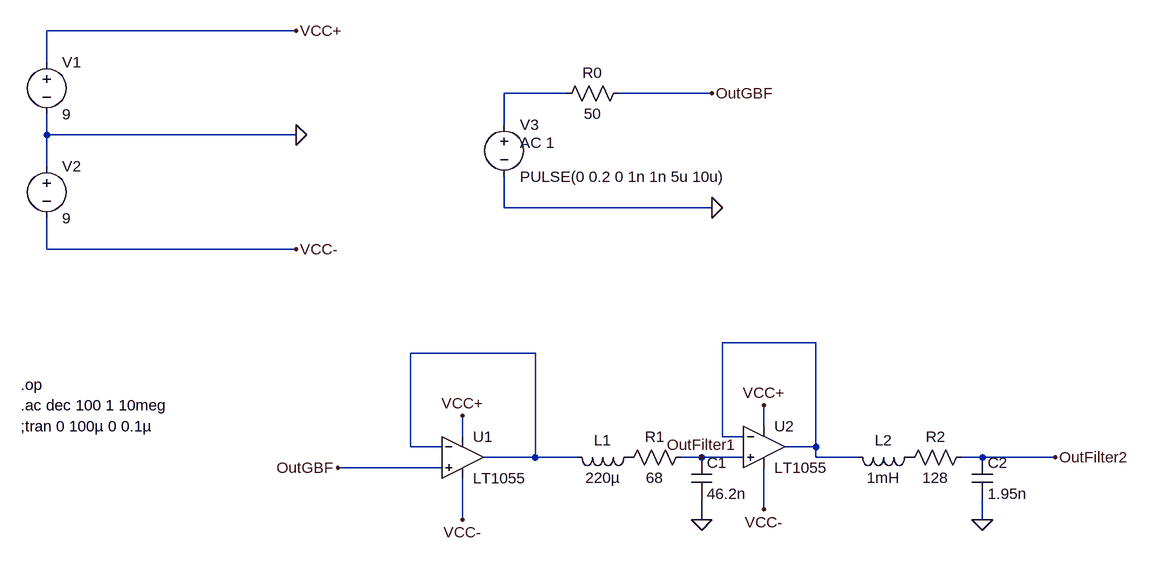
[diagram p0: schematic Draft1.asc]
Draft1.asc, the LTspice schematic file:
Version 4
SHEET 1 1160 680
WIRE -192 -496 -576 -496
WIRE -576 -448 -576 -496
WIRE 224 -400 128 -400
WIRE 448 -400 304 -400
WIRE 128 -352 128 -400
WIRE -576 -336 -576 -368
WIRE -192 -336 -576 -336
WIRE -576 -288 -576 -336
WIRE 128 -224 128 -272
WIRE 448 -224 128 -224
WIRE -576 -160 -576 -208
WIRE -192 -160 -576 -160
WIRE 608 -16 464 -16
WIRE 176 0 -16 0
WIRE 528 112 528 80
WIRE 64 128 64 96
WIRE 464 128 464 -16
WIRE 496 128 464 128
WIRE -16 144 -16 0
WIRE 32 144 -16 144
WIRE 608 144 608 -16
WIRE 608 144 560 144
WIRE 176 160 176 0
WIRE 176 160 96 160
WIRE 240 160 176 160
WIRE 432 160 400 160
WIRE 496 160 432 160
WIRE 608 160 608 144
WIRE 672 160 608 160
WIRE 864 160 832 160
WIRE 976 160 864 160
WIRE 32 176 -128 176
WIRE 528 240 528 176
WIRE 64 256 64 192
WIRE 432 256 432 224
WIRE 864 256 864 224
FLAG 64 96 VCC+
FLAG 64 256 VCC-
FLAG 528 80 VCC+
FLAG 528 240 VCC-
FLAG 432 256 0
FLAG 864 256 0
FLAG -128 176 OutGBF
FLAG 432 160 OutFilter1
FLAG 976 160 OutFilter2
FLAG -192 -336 0
FLAG 448 -224 0
FLAG -192 -496 VCC+
FLAG -192 -160 VCC-
FLAG 448 -400 OutGBF
SYMBOL OpAmps\\LT1055 64 96 R0
SYMATTR InstName U1
SYMBOL ind 336 144 R90
WINDOW 0 5 56 VBottom 2
WINDOW 3 32 56 VTop 2
SYMATTR InstName L1
SYMATTR Value 220µ
SYMBOL ind 768 144 R90
WINDOW 0 5 56 VBottom 2
WINDOW 3 32 56 VTop 2
SYMATTR InstName L2
SYMATTR Value 1mH
SYMBOL res 416 144 R90
WINDOW 0 0 56 VBottom 2
WINDOW 3 32 56 VTop 2
SYMATTR InstName R1
SYMATTR Value 68
SYMBOL res 848 144 R90
WINDOW 0 0 56 VBottom 2
WINDOW 3 32 56 VTop 2
SYMATTR InstName R2
SYMATTR Value 128
SYMBOL cap 416 160 R0
SYMATTR InstName C1
SYMATTR Value 46.2n
SYMBOL cap 848 160 R0
SYMATTR InstName C2
SYMATTR Value 1.95n
SYMBOL OpAmps\\LT1055 528 80 R0
SYMATTR InstName U2
SYMBOL voltage -576 -464 R0
WINDOW 123 0 0 Left 0
WINDOW 39 0 0 Left 0
SYMATTR InstName V1
SYMATTR Value 9
SYMBOL voltage -576 -304 R0
WINDOW 123 0 0 Left 0
WINDOW 39 0 0 Left 0
SYMATTR InstName V2
SYMATTR Value 9
SYMBOL voltage 128 -368 R0
WINDOW 123 24 44 Left 2
WINDOW 39 0 0 Left 0
SYMATTR Value2 AC 1
SYMATTR InstName V3
SYMATTR Value PULSE(0 0.2 0 1n 1n 5u 10u)
SYMBOL res 320 -416 R90
WINDOW 0 0 56 VBottom 2
WINDOW 3 32 56 VTop 2
SYMATTR InstName R0
SYMATTR Value 50
TEXT -616 48 Left 2 !.op
TEXT -616 80 Left 2 !.ac dec 100 1 10meg
TEXT -616 112 Left 2 !;tran 0 100µ 0 0.1µ

The netlist it stands for:
* Draft1.asc
XU1 OutGBF N003 VCC+ VCC- N003 LT1055  ; pins In+ In- V+ V- OUT
L1 P001 N003 220µ
L2 P002 N002 1mH
R1 OutFilter1 P001 68
R2 OutFilter2 P002 128
C1 OutFilter1 0 46.2n
C2 OutFilter2 0 1.95n
XU2 OutFilter1 N002 VCC+ VCC- N002 LT1055  ; pins In+ In- V+ V- OUT
V1 VCC+ 0 9
V2 0 VCC- 9
V3 N001 0 PULSE(0 0.2 0 1n 1n 5u 10u) AC 1
R0 OutGBF N001 50
.op
.ac dec 100 1 10meg
;tran 0 100µ 0 0.1µ
.backanno
.end

* Results of the author's LTspice run, read from the files saved beside the schematic
* Operating Point, zero values left out:
*   V(vcc+) = 9 V
*   V(vcc-) = -9 V
*   I(V2) = -5.6 mA
*   I(V1) = -5.6 mA
*   Ix(u1:3) = 2.8 mA
*   Ix(u1:4) = -2.8 mA
*   Ix(u2:3) = 2.8 mA
*   Ix(u2:4) = -2.8 mA
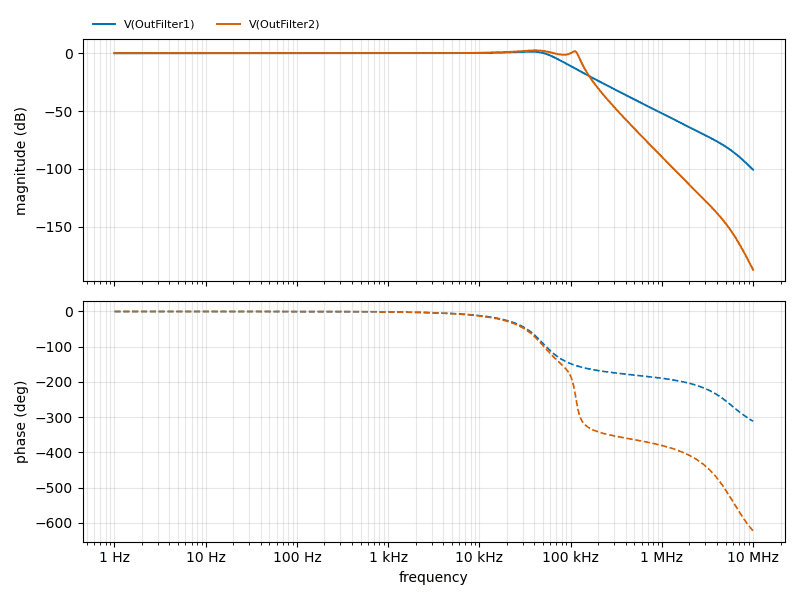
[diagram p1: AC Analysis of Draft1.asc, plotted from the saved traces]
* AC Analysis, 1 run:
*   V(OutFilter1): -0.00 dB at 1 Hz, -100.75 dB at 10 MHz, peak 1.35 dB at 35.48 kHz, 3 dB below the peak at 58.36 kHz
*   V(OutFilter2): -0.00 dB at 1 Hz, -187.15 dB at 10 MHz, peak 2.38 dB at 40.74 kHz, 3 dB below the peak at 70.53 kHz
* From the log:
*   Semiconductor Device Operating Points:
*                           --- Diodes ---
*   Name:    d:u2:3      d:u2:6      d:u2:5      d:u2:4      d:u2:1
*   Model:    u2:dc       u2:y        u2:y        u2:x        u2:x
*   Id:      1.00e-04    5.78e-40   -5.78e-40   -9.00e-11   -9.00e-11
*   Vd:      1.80e+01    5.77e-28   -5.77e-28   -9.00e+00   -9.00e+00
*   Req:     1.00e-02    1.00e-12    1.00e-12    1.00e-11    1.00e-11
*   CAP:     0.00e+00    0.00e+00    0.00e+00    0.00e+00    0.00e+00
*   Name:    d:u1:3      d:u1:6      d:u1:5      d:u1:4      d:u1:1
*   Model:    u1:dc       u1:y        u1:y        u1:x        u1:x
*   Id:      1.00e-04   -4.62e-40    4.62e-40   -9.00e-11   -9.00e-11
*   Vd:      1.80e+01   -4.62e-28    4.62e-28   -9.00e+00   -9.00e+00
*   Req:     1.00e-02    1.00e-12    1.00e-12    1.00e-11    1.00e-11
*   CAP:     0.00e+00    0.00e+00    0.00e+00    0.00e+00    0.00e+00
*                           --- VDMOSFET Transistors ---
*   Name:        m:u2:2      m:u2:1      m:u1:2      m:u1:1
*   Model:        u2:p        u2:n        u1:p        u1:n
*   Id:         -2.70e-03    2.70e-03   -2.70e-03    2.70e-03
*   Vgs:        -5.77e-28   -5.77e-28    4.62e-28    4.62e-28
*   Vds:        -9.00e+00    9.00e+00   -9.00e+00    9.00e+00
*   Vth:         3.00e-01   -3.00e-01    3.00e-01   -3.00e-01
*   Gm:          1.80e-02    1.80e-02    1.80e-02    1.80e-02
*   Gds:         0.00e+00    0.00e+00    0.00e+00    0.00e+00
*   Cgs:         0.00e+00    0.00e+00    0.00e+00    0.00e+00
*   Cgd:         0.00e+00    0.00e+00    0.00e+00    0.00e+00
*   Cbody:       0.00e+00    0.00e+00    0.00e+00    0.00e+00